# Altium schematic sheet SINTETIZADOR Y DDS SLAVE.SchDoc
size A3; SheetNumber: 5; SheetTotal: 6
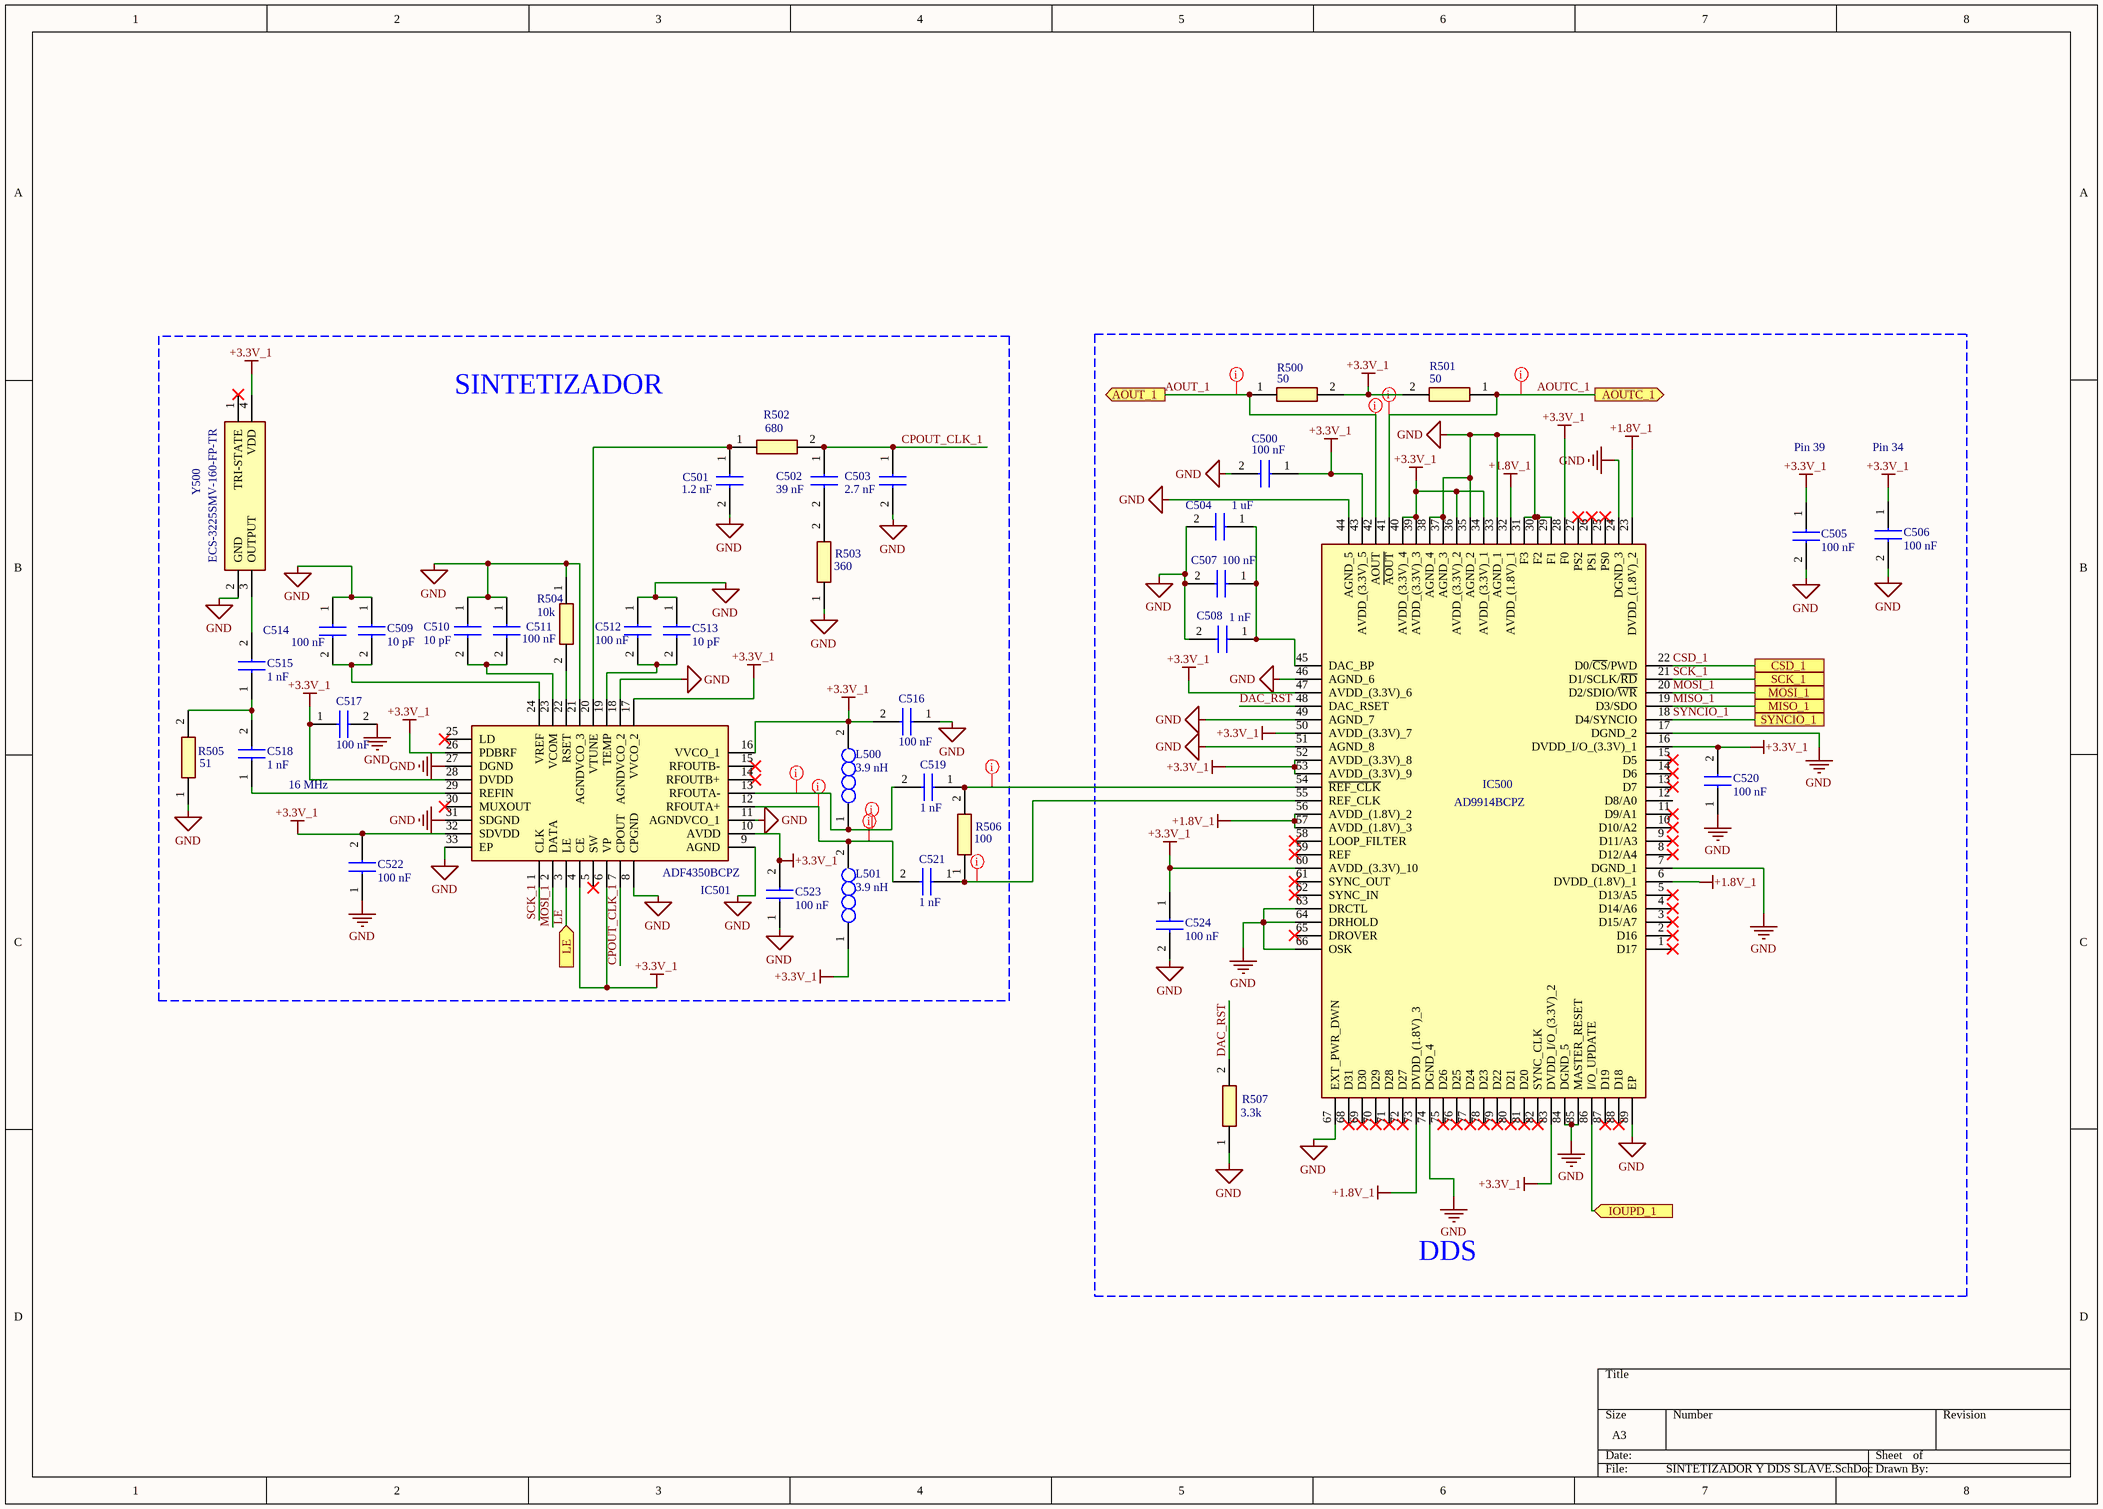
[diagram p0: SINTETIZADOR Y DDS SLAVE.SchDoc]

## Parts
C500  100 nF  [C0603]
C501  1.2 nF  [C0603]
C502  39 nF  [C0603]
C503  2.7 nF  [C0603]
C504  1 uF  [C0603]
C505  100 nF  [C0603]
C506  100 nF  [C0603]
C507  100 nF  [C0603]
C508  1 nF  [C0603]
C509  10 pF  [C0603]
C510  10 pF  [C0603]
C511  100 nF  [C0603]
C512  100 nF  [C0603]
C513  10 pF  [C0603]
C514  100 nF  [C0603]
C515  1 nF  [C0603]
C516  100 nF  [C0603]
C517  100 nF  [C0603]
C518  1 nF  [C0603]
C519  1 nF  [C0603]
C520  100 nF  [C0603]
C521  1 nF  [C0603]
C522  100 nF  [C0603]
C523  100 nF  [C0603]
C524  100 nF  [C0603]
IC500  AD9914BCPZ  [QFN50P1200X1200X90-89N-D]
IC501  ADF4350BCPZ  [QFN50P500X500X100-33N]
L500  3.9 nH  [INDC1608X95N]
L501  3.9 nH  [INDC1608X95N]
R500  50  [RESC1608X55N]
R501  50  [RESC1608X55N]
R502  680  [RESC1608X55N]
R503  360  [RESC1608X55N]
R504  10k  [RESC1608X55N]
R505  51  [RESC1608X55N]
R506  100  [RESC1608X55N]
R507  3.3k  [RESC1608X55N]
Y500  ECS-3225SMV-160-FP-TR  [ECS3225SMV160FPTR]

## Blocks framed on the sheet
SINTETIZADOR: C501-C503 C509-C519 C521-C523 IC501 L500 L501 R502-R506 Y500
DDS: C500 C504-C508 C520 C524 IC500 R500 R501 R507

## Ports
AOUT_1 (out), AOUTC_1 (out), CSD_1, IOUPD_1 (in), LE (in), MISO_1, MOSI_1, SCK_1, SYNCIO_1

## Nets
+1.8V_1: IC500.6(DVDD_(1.8V)_1) IC500.23(DVDD_(1.8V)_2) IC500.32(AVDD_(1.8V)_1) IC500.56(AVDD_(1.8V)_2) IC500.57(AVDD_(1.8V)_3) IC500.73(DVDD_(1.8V)_3)
+3.3V_1: C500.1 C505.1 C506.1 C516.2 C517.1 C520.2 C522.2 C523.2 C524.1 IC500.16(DVDD_I/O_(3.3V)_1) IC500.28(F0) IC500.34(AVDD_(3.3V)_1) IC500.36(AVDD_(3.3V)_2) IC500.39(AVDD_(3.3V)_3) IC500.40(AVDD_(3.3V)_4) IC500.43(AVDD_(3.3V)_5) IC500.47(AVDD_(3.3V)_6) IC500.50(AVDD_(3.3V)_7) IC500.52(AVDD_(3.3V)_8) IC500.53(AVDD_(3.3V)_9) IC500.60(AVDD_(3.3V)_10) IC500.83(DVDD_I/O_(3.3V)_2) IC501.4(CE) IC501.6(VP) IC501.10(AVDD) IC501.16(VVCO_1) IC501.17(VVCO_2) IC501.26(PDBRF) IC501.28(DVDD) IC501.32(SDVDD) L500.2 L501.1 R500.2 R501.2 Y500.4(VDD)
GND: C500.2 C501.2 C503.2 C504.2 C505.2 C506.2 C507.2 C508.2 C509.1 C510.1 C511.1 C512.1 C513.1 C514.1 C516.1 C517.2 C520.1 C522.1 C523.1 C524.2 IC500.7(DGND_1) IC500.17(DGND_2) IC500.24(DGND_3) IC500.29(F1) IC500.30(F2) IC500.31(F3) IC500.33(AGND_1) IC500.35(AGND_2) IC500.37(AGND_3) IC500.38(AGND_4) IC500.44(AGND_5) IC500.46(AGND_6) IC500.49(AGND_7) IC500.51(AGND_8) IC500.63(DRCTL) IC500.64(DRHOLD) IC500.66(OSK) IC500.67(EXT_PWR_DWN) IC500.74(DGND_4) IC500.84(DGND_5) IC500.85(MASTER_RESET) IC500.89(EP) IC501.8(CPGND) IC501.9(AGND) IC501.11(AGNDVCO_1) IC501.18(AGNDVCO_2) IC501.21(AGNDVCO_3) IC501.27(DGND) IC501.31(SDGND) IC501.33(EP) R503.1 R504.1 R505.1 R507.1 Y500.2(GND)
AOUT_1: IC500.42(AOUT) R500.1 ; port AOUT_1
AOUTC_1: IC500.41(~{AOUT}) R501.1 ; port AOUTC_1
CPOUT_CLK_1: C502.1 C503.1 IC501.7(CPOUT) R502.2
CSD_1: IC500.22(D0/~{CS}/PWD) ; port CSD_1
DAC_RST: IC500.48(DAC_RSET) R507.2
IOUPD_1: IC500.86(I/O_UPDATE) ; port IOUPD_1
LE: IC501.3(LE) ; port LE
MISO_1: IC500.19(D3/SDO) ; port MISO_1
MOSI_1: IC500.20(D2/SDIO/~{WR}) IC501.2(DATA) ; port MOSI_1
SCK_1: IC500.21(D1/SCLK/~{RD}) IC501.1(CLK) ; port SCK_1
SYNCIO_1: IC500.18(D4/SYNCIO) ; port SYNCIO_1
NetC501_1: C501.1 IC501.20(VTUNE) R502.1
NetC502_2: C502.2 R503.2
NetC504_1: C504.1 C507.1 C508.1 IC500.45(DAC_BP)
NetC509_2: C509.2 C514.2 IC501.24(VREF)
NetC510_2: C510.2 C511.2 IC501.23(VCOM)
NetC512_2: C512.2 C513.2 IC501.19(TEMP)
NetC515_1: C515.1 C518.2 R505.2
NetC515_2: C515.2 Y500.3(OUTPUT)
NetC518_1: C518.1 IC501.29(REFIN)
NetC519_1: C519.1 IC500.54(~{REF_CLK}) R506.2
NetC519_2: C519.2 IC501.13(RFOUTA-) L500.1
NetC521_1: C521.1 IC500.55(REF_CLK) R506.1
NetC521_2: C521.2 IC501.12(RFOUTA+) L501.2
NetIC501_22: IC501.22(RSET) R504.2

Not connected (* = marked no-connect by the designer): IC500 1(D17)* 2(D16)* 3(D15/A7)* 4(D14/A6)* 5(D13/A5)* 8(D12/A4)* 9(D11/A3)* 10(D10/A2)* 11(D9/A1)* 12(D8/A0) 13(D7)* 14(D6)* 15(D5)* 25(PS0)* 26(PS1)* 27(PS2)* 58(LOOP_FILTER)* 59(REF)* 61(SYNC_OUT)* 62(SYNC_IN)* 65(DROVER)* 68(D31)* 69(D30)* 70(D29)* 71(D28)* 72(D27)* 75(D26)* 76(D25)* 77(D24)* 78(D23)* 79(D22)* 80(D21)* 81(D20)* 82(SYNC_CLK)* 87(D19)* 88(D18)*; IC501 5(SW)* 14(RFOUTB+)* 15(RFOUTB-)* 25(LD)* 30(MUXOUT)*; Y500 1(TRI-STATE)*

## Layout directives
net class RF: AOUT_1, AOUTC_1, NetC519_1, NetC519_2, NetC521_1, NetC521_2

## Notes on the sheet
- Pin 39
- Pin 34
- 16 MHz

## Library data of the parts
C500-C524 = C0603H470J5GACTU: Capacitor; Manufacturer_Name: KEMET; Datasheet Link: https://content.kemet.com/datasheets/KEM_C1001_C0G_200C_SMD.pdf; Height: 0.87mm; Manufacturer_Part_Number: C0603H470J5GACTU
IC500 = AD9914BCPZ: Integrated Circuit; Manufacturer_Name: Analog Devices; Datasheet Link: https://componentsearchengine.com/Datasheets/1/AD9914BCPZ.pdf; Height: 0.9mm; Manufacturer_Part_Number: AD9914BCPZ; Mouser Part Number: 584-AD9914BCPZ; Mouser Price/Stock: https://www.mouser.co.uk/ProductDetail/Analog-Devices/AD9914BCPZ?qs=BpaRKvA4VqHC4wK2pFXfVw%3D%3D; Arrow Part Number: AD9914BCPZ; Arrow Price/Stock: https://www.arrow.com/en/products/ad9914bcpz/analog-devices?region=nac
IC501 = ADF4350BCPZ: Integrated Circuit; Manufacturer_Name: Analog Devices; Datasheet Link: https://datasheet.datasheetarchive.com/originals/distributors/Datasheets-SFU1/DSASFU10004634.pdf; Height: 1mm; Manufacturer_Part_Number: ADF4350BCPZ; Mouser Part Number: 584-ADF4350BCPZ; Mouser Price/Stock: https://www.mouser.co.uk/ProductDetail/Analog-Devices/ADF4350BCPZ?qs=BpaRKvA4VqGt2ZHwONikjQ%3D%3D; Arrow Part Number: ADF4350BCPZ; Arrow Price/Stock: https://www.arrow.com/en/products/adf4350bcpz/analog-devices?region=nac
L500 L501 = AIML-0603-100K-T: Inductor; Manufacturer_Name: ABRACON; Datasheet Link: https://abracon.com/Magnetics/new/AIML-0603.pdf; Height: 0.95mm; Manufacturer_Part_Number: AIML-0603-100K-T; Mouser Part Number: 815-AIML-0603-100KT; Mouser Price/Stock: https://www.mouser.co.uk/ProductDetail/ABRACON/AIML-0603-100K-T?qs=1vO2EIVe%252BY5tBY%252BpVVThrw%3D%3D; Arrow Part Number: AIML-0603-100K-T; Arrow Price/Stock: https://www.arrow.com/en/products/aiml-0603-100k-t/abracon?region=nac
R500-R507 = CR0603-FX-1431ELF: Resistor; Manufacturer_Name: Bourns; Datasheet Link: https://www.bourns.com/pdfs/chpreztr.pdf; Height: 0.55mm; Manufacturer_Part_Number: CR0603-FX-1431ELF; Mouser Part Number: 652-CR0603FX-1431ELF; Mouser Price/Stock: https://www.mouser.co.uk/ProductDetail/Bourns/CR0603-FX-1431ELF?qs=e7cxVwPieurCzASkAzK2%252Bg%3D%3D
Y500 = ECS-3225SMV-160-FP-TR: Crystal or Oscillator; Manufacturer_Name: ECS; Datasheet Link: https://datasheet.datasheetarchive.com/originals/distributors/Datasheets_SAMA/aca54b4a763fa6b74cd8d2921d99cf9f.pdf; Height: 1.2mm; Manufacturer_Part_Number: ECS-3225SMV-160-FP-TR; Mouser Part Number: 520-3225SMV-160-FPT; Mouser Price/Stock: https://www.mouser.co.uk/ProductDetail/ECS/ECS-3225SMV-160-FP-TR?qs=%252B6g0mu59x7IhPTRSFb%2Fsjg%3D%3D; Arrow Part Number: ECS-3225SMV-160-FP-TR; Arrow Price/Stock: https://www.arrow.com/en/products/ecs-3225smv-160-fp-tr/ecs-international?region=nac